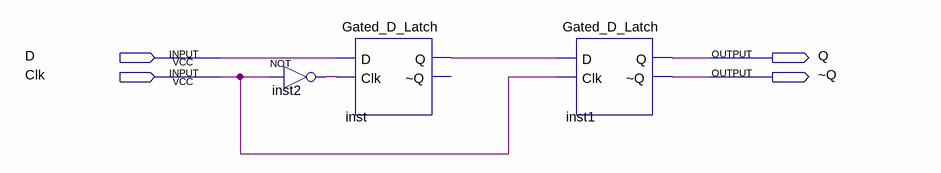
[diagram p0: schematic sheet]
// Quartus schematic Positive_Edge_MSDFF.bdf as structural Verilog: 3 symbols, 4 pins
module Positive_Edge_MSDFF (
  input  D,
  input  Clk,
  output Q,
  output \~Q 
);

  wire inst2_out, inst_q;

  not inst2 (inst2_out, Clk);
  Gated_D_Latch inst (.D(D), .Clk(inst2_out), .Q(inst_q));  // open: ~Q
  Gated_D_Latch inst1 (.D(inst_q), .Clk(Clk), .Q(Q), .\~Q (\~Q ));
endmodule
